# Altium schematic sheet Ethernet2_Power.SchDoc
size A4; DocumentNumber: 19; SheetNumber: 19; SheetTotal: 47
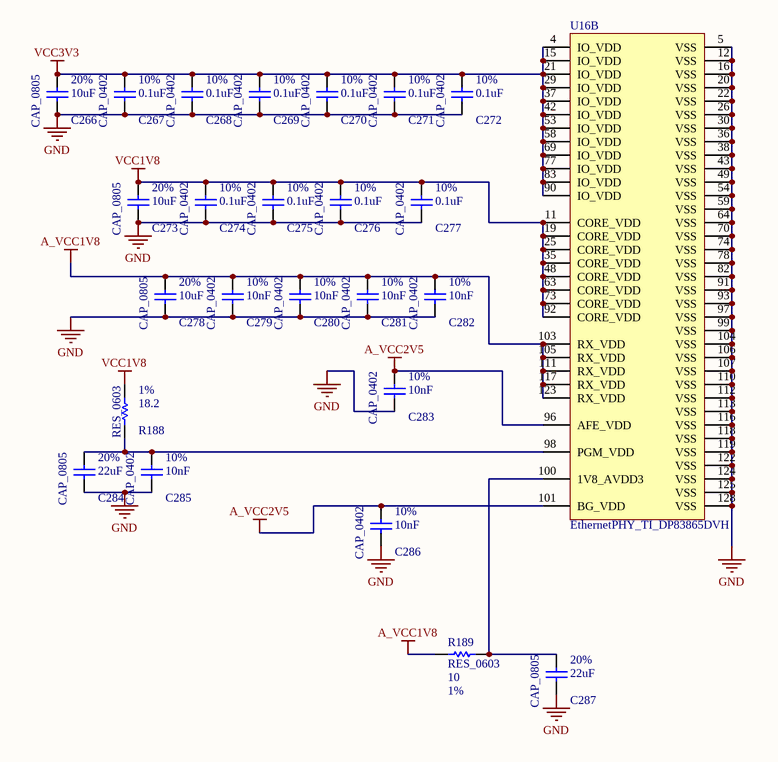
[diagram p0: Ethernet2_Power.SchDoc]

## Parts
C266  CAP_0805  value 10uF  Tolerance: 20%  [CAPC0805(2012)75_N]
C267  CAP_0402  value 0.1uF  Tolerance: 10%  [CAPC0402(1005)60_N]
C268  CAP_0402  value 0.1uF  Tolerance: 10%  [CAPC0402(1005)60_N]
C269  CAP_0402  value 0.1uF  Tolerance: 10%  [CAPC0402(1005)60_N]
C270  CAP_0402  value 0.1uF  Tolerance: 10%  [CAPC0402(1005)60_N]
C271  CAP_0402  value 0.1uF  Tolerance: 10%  [CAPC0402(1005)60_N]
C272  CAP_0402  value 0.1uF  Tolerance: 10%  [CAPC0402(1005)60_N]
C273  CAP_0805  value 10uF  Tolerance: 20%  [CAPC0805(2012)75_N]
C274  CAP_0402  value 0.1uF  Tolerance: 10%  [CAPC0402(1005)60_N]
C275  CAP_0402  value 0.1uF  Tolerance: 10%  [CAPC0402(1005)60_N]
C276  CAP_0402  value 0.1uF  Tolerance: 10%  [CAPC0402(1005)60_N]
C277  CAP_0402  value 0.1uF  Tolerance: 10%  [CAPC0402(1005)60_N]
C278  CAP_0805  value 10uF  Tolerance: 20%  [CAPC0805(2012)75_N]
C279  CAP_0402  value 10nF  Tolerance: 10%  [CAPC0402(1005)60_N]
C280  CAP_0402  value 10nF  Tolerance: 10%  [CAPC0402(1005)60_N]
C281  CAP_0402  value 10nF  Tolerance: 10%  [CAPC0402(1005)60_N]
C282  CAP_0402  value 10nF  Tolerance: 10%  [CAPC0402(1005)60_N]
C283  CAP_0402  value 10nF  Tolerance: 10%  [CAPC0402(1005)60_N]
C284  CAP_0805  value 22uF  Tolerance: 20%  [CAPC0805(2012)75_N]
C285  CAP_0402  value 10nF  Tolerance: 10%  [CAPC0402(1005)60_N]
C286  CAP_0402  value 10nF  Tolerance: 10%  [CAPC0402(1005)60_N]
C287  CAP_0805  value 22uF  Tolerance: 20%  [CAPC0805(2012)75_N]
R188  RES_0603  value 18.2  Tolerance: 1%  [RESC0603(1608)_N]
R189  RES_0603  value 10  Tolerance: 1%  [RESC0603(1608)_N]
U16  EthernetPHY_TI_DP83865DVH  [EthernetPHY_TI_DP83865(PQFP)_VLA128A_N]  (part B of 2)

## Nets
A_VCC1V8: C278.2 C279.2 C280.2 C281.2 C282.2 R189.2 U16.103(RX_VDD) U16.105(RX_VDD) U16.111(RX_VDD) U16.117(RX_VDD) U16.123(RX_VDD)
A_VCC2V5: C283.2 C286.2 U16.96(AFE_VDD) U16.101(BG_VDD)
GND: C266.1 C267.1 C268.1 C269.1 C270.1 C271.1 C272.1 C273.1 C274.1 C275.1 C276.1 C277.1 C278.1 C279.1 C280.1 C281.1 C282.1 C283.1 C284.1 C285.1 C286.1 C287.1 U16.5(VSS) U16.12(VSS) U16.16(VSS) U16.20(VSS) U16.22(VSS) U16.26(VSS) U16.30(VSS) U16.36(VSS) U16.38(VSS) U16.43(VSS) U16.49(VSS) U16.54(VSS) U16.59(VSS) U16.64(VSS) U16.70(VSS) U16.74(VSS) U16.78(VSS) U16.82(VSS) U16.91(VSS) U16.93(VSS) U16.97(VSS) U16.99(VSS) U16.104(VSS) U16.106(VSS) U16.107(VSS) U16.110(VSS) U16.112(VSS) U16.113(VSS) U16.116(VSS) U16.118(VSS) U16.119(VSS) U16.122(VSS) U16.124(VSS) U16.125(VSS) U16.128(VSS)
VCC1V8: C273.2 C274.2 C275.2 C276.2 C277.2 R188.2 U16.11(CORE_VDD) U16.19(CORE_VDD) U16.25(CORE_VDD) U16.35(CORE_VDD) U16.48(CORE_VDD) U16.63(CORE_VDD) U16.73(CORE_VDD) U16.92(CORE_VDD)
VCC3V3: C266.2 C267.2 C268.2 C269.2 C270.2 C271.2 C272.2 U16.4(IO_VDD) U16.15(IO_VDD) U16.21(IO_VDD) U16.29(IO_VDD) U16.37(IO_VDD) U16.42(IO_VDD) U16.53(IO_VDD) U16.58(IO_VDD) U16.69(IO_VDD) U16.77(IO_VDD) U16.83(IO_VDD) U16.90(IO_VDD)
NetC284_2: C284.2 C285.2 R188.1 U16.98(PGM_VDD)
NetC287_2: C287.2 R189.1 U16.100(1V8_AVDD3)

## Library data of the parts
C266 C273 C278 = ECJ-2FB0J106M: 10uF, ceramic, 20%, 6.3V, X5R 0805; Manufacturer: Panasonic - ECG; Part Number: ECJ-2FB0J106M; Footprint Ref: CAPC0805(2012)75_N; Library Ref: CAP_0805
C267-C272 C274-C277 = CAP_0402: 0.1uf, ceramic, 10%, 6.3V, X5R, 0402; Part Number: C1005X5R0J104K; Manufacturer: TDK Corporation; Footprint Ref: CAPC0402(1005)60_N; Library Ref: CAP_0402
C279-C283 C285 C286 = CAP_0402: 10000pF, ceramic, 10% 6.3V X5R, 0402; Part Number: GRM155R60J103KA01D; Manufacturer: Murata Electronics North America; Footprint Ref: CAPC0402(1005)60_N; Library Ref: CAP_0402
C284 C287 = JMK212BJ226MG-T: 22uF, ceramic, 20%, 6.3V, X5R, 0805; Manufacturer: Taiyo Yuden; Part Number: JMK212BJ226MG-T; Footprint Ref: CAPC0805(2012)75_N; Library Ref: CAP_0805
R188 = ERJ-3EKF18R2V: RES 18.2 OHM 1/10W 1% 0603 SMD; Manufacturer: Panasonic Electronics Components; Part Number: ERJ-3EKF18R2V; Footprint Ref: RESC0603(1608)_N; Library Ref: RES_0603
R189 = ERJ-3EKF10R0V: RES 10.0 OHM 1/10W 1% 0603 SMD; Manufacturer: Panasonic Electronics Components; Part Number: ERJ-3EKF10R0V; Footprint Ref: RESC0603(1608)_N; Library Ref: RES_0603
U16 = DP83865DVH: Ethernet PHY_TI_DP83865DVH, Gigabit Ethernet PHYTER,128 Lead Plastic Flat Pack; Manufacturer: Texas Instruments; Part Number: DP83865DVH